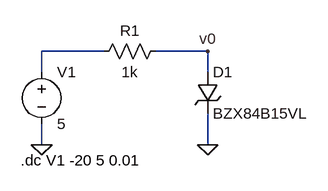
[diagram p0: schematic BZX84B15VL.asc]
BZX84B15VL.asc, the LTspice schematic file:
Version 4
SHEET 1 880 680
WIRE 128 112 32 112
WIRE 288 112 208 112
WIRE 32 144 32 112
WIRE 288 144 288 112
WIRE 32 256 32 224
WIRE 288 256 288 208
FLAG 288 256 0
FLAG 32 256 0
FLAG 288 112 v0
SYMBOL res 224 96 R90
WINDOW 0 0 56 VBottom 2
WINDOW 3 32 56 VTop 2
SYMATTR InstName R1
SYMATTR Value 1k
SYMBOL zener 272 144 R0
SYMATTR InstName D1
SYMATTR Value BZX84B15VL
SYMATTR Description Diode
SYMATTR Type diode
SYMBOL voltage 32 128 R0
WINDOW 123 0 0 Left 0
WINDOW 39 0 0 Left 0
SYMATTR InstName V1
SYMATTR Value 5
TEXT 0 280 Left 2 !.dc V1 -20 5 0.01

The netlist it stands for:
* BZX84B15VL.asc
R1 v0 N001 1k
D1 v0 0 BZX84B15VL
V1 N001 0 5
.model D D
.lib standard.dio
.dc V1 -20 5 0.01
.backanno
.end

* Results of the author's LTspice run, read from the files saved beside the schematic
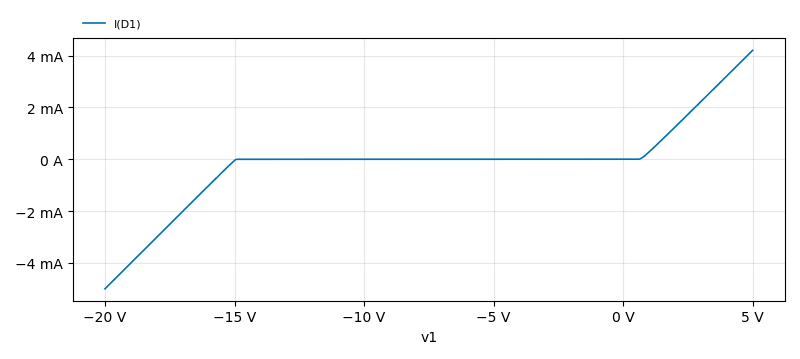
[diagram p1: DC transfer characteristic of BZX84B15VL.asc, plotted from the saved traces]
* DC transfer characteristic, 1 run:
*   I(D1): -4.999 mA at v1=-20 V, 4.204 mA at v1=5 V, min -4.999 mA, max 4.204 mA